# Altium schematic sheet CLK_MUX.schdoc: TEBF0808 - CLK
size A4; DocumentNumber: TEBF0808; Revision: 04; SheetNumber: 23; SheetTotal: 36; Date: 2016-09-29; CompanyName: Trenz Electronic GmbH; Organization: Trenz Electronic GmbH
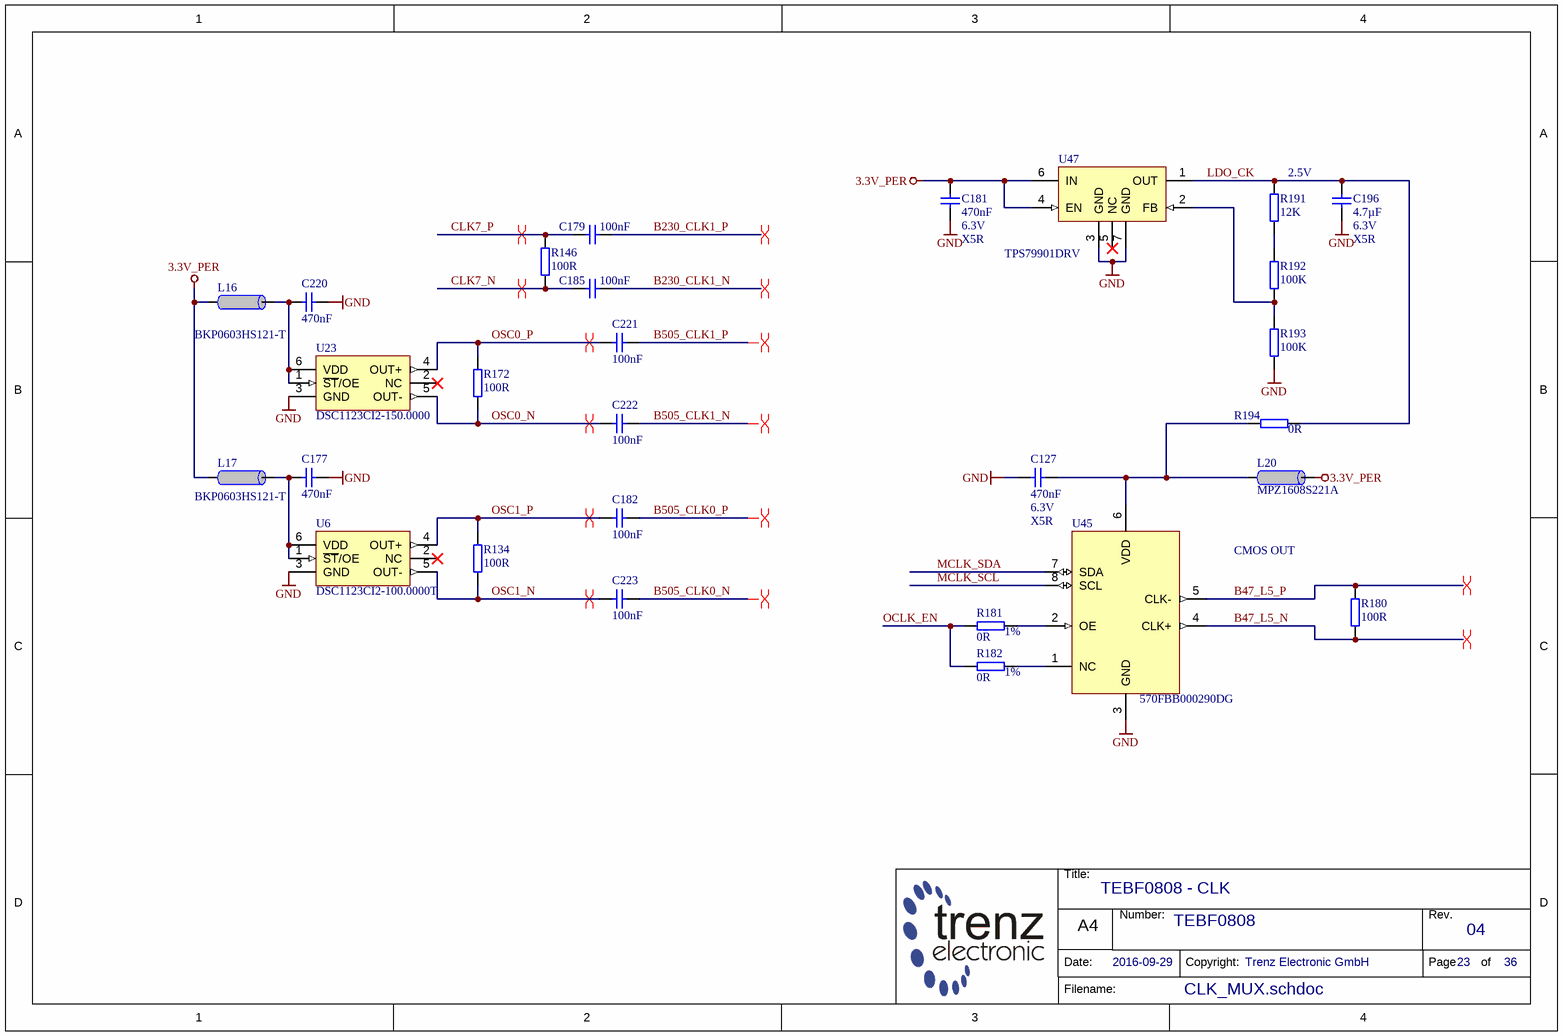
[diagram p0: CLK_MUX.schdoc]

## Parts
C127  470nF  Voltage: 6.3V  Technology: X5R  [CAPC1005X55N]
C177  470nF  [CAPC0603X33N]
C179  100nF  [CAPC0603X33N]
C181  470nF  Voltage: 6.3V  Technology: X5R  [CAPC1005X55N]
C182  100nF  [CAPC0603X33N]
C185  100nF  [CAPC0603X33N]
C196  4.7µF  Voltage: 6.3V  Technology: X5R  [CAPC1005X60N]
C220  470nF  [CAPC0603X33N]
C221  100nF  [CAPC0603X33N]
C222  100nF  [CAPC0603X33N]
C223  100nF  [CAPC0603X33N]
L16  BKP0603HS121-T  [INDC0603X33N]
L17  BKP0603HS121-T  [INDC0603X33N]
L20  MPZ1608S221A  [INDC1608X95N]
R134  100R  [RESC0603X26N]
R146  100R  [RESC1005X40N]
R172  100R  [RESC0603X26N]
R180  100R  [RESC1005X40N]
R181  0R  Tolerance: 1%  [RESC1005X40N]
R182  0R  Tolerance: 1%  [RESC1005X40N]
R191  12K  [RESC1005X40N]
R192  100K  [RESC1005X40N]
R193  100K  [RESC1005X40N]
R194  0R  [RESC1005X40N]
U6  DSC1123CI2-100.0000T  [PSON105P320X250X90-6N]
U23  DSC1123CI2-150.0000  [PSON105P320X250X90-6N]
U45  570FBB000290DG  [OSCCC500X700X180-8N]
U47  TPS79901DRV  [SON65P200X210X80-7N-TI]

## Nets
3.3V_PER: C181.2 L16.1 L17.1 L20.2 U47.4(EN) U47.6(IN)
GND: C127.1 C177.1 C181.1 C196.2 C220.1 R193.1 U6.3(GND) U23.3(GND) U45.3(GND) U47.3(GND) U47.7(GND)
B47_L5_N: R180.2 U45.4(CLK+)
B47_L5_P: R180.1 U45.5(CLK-)
B230_CLK1_N: C185.2
B230_CLK1_P: C179.2
B505_CLK0_N: C223.2
B505_CLK0_P: C182.2
B505_CLK1_N: C222.2
B505_CLK1_P: C221.2
CLK7_N: C185.1 R146.2
CLK7_P: C179.1 R146.1
LDO_CK: C196.1 R191.1 R194.1 U47.1(OUT)
MCLK_SCL: U45.8(SCL)
MCLK_SDA: U45.7(SDA)
OCLK_EN: R181.1 R182.1
OSC0_N: C222.1 R172.1 U23.5(OUT-)
OSC0_P: C221.1 R172.2 U23.4(OUT+)
OSC1_N: C223.1 R134.1 U6.5(OUT-)
OSC1_P: C182.1 R134.2 U6.4(OUT+)
NetC127_2: C127.2 L20.1 R194.2 U45.6(VDD)
NetC177_2: C177.2 L17.2 U6.1(~{ST}/OE) U6.6(VDD)
NetC220_2: C220.2 L16.2 U23.1(~{ST}/OE) U23.6(VDD)
NetR181_2: R181.2 U45.2(OE)
NetR182_2: R182.2 U45.1(NC)
NetR191_2: R191.2 R192.2
NetR192_1: R192.1 R193.2 U47.2(FB)

Not connected (* = marked no-connect by the designer): U6 2(NC)*; U23 2(NC)*; U47 5(NC)*

## Layout directives
differential pair: B47_L5_N, B47_L5_P, B230_CLK1_N, B230_CLK1_P, B505_CLK0_N, B505_CLK0_P, B505_CLK1_N, B505_CLK1_P, CLK7_N, CLK7_P, OSC0_N, OSC0_P, OSC1_N, OSC1_P

## Notes on the sheet
- 2.5V
- CMOS OUT
- Title:
- Number:
- Rev.
- Date:
- A4
- Copyright:
- Page
- of
- Filename:

## Library data of the parts
C127 C181 = 23659: KON 470nF 6,3V X5R SMD; AN: 23659; Value: 470n; Mixed: SMT; Preferred: Yes; Case: 1005 (0402)
C177 C220 = 24921: KON 470nF X5R 6.3V SMD 20%; AN: 24921; Mixed: SMT; Value: 470n; Preferred: Yes; Voltage: 6.3V; Technology: X5R; Case: 0603 (0201); Tolerance: 20%
C179 C182 C185 C221-C223 = 24915: KON 100nF 6.3V X5R SMD 10%; AN: 24915; Mixed: SMT; Value: 100n; Preferred: Yes; Voltage: 6.3V; Technology: X5R; Case: 0603 (0201); Tolerance: 10%
C196 = 24719: KON 4.7µF 6.3V X5R SMD 20%; AN: 24719; Mixed: SMT; Value: 4.7u; Preferred: Yes; Case: 1005 (0402); Tolerance: 20%
L16 L17 = 25393: Ferritdurchführung SMD 0201; AN: 25393; Mixed: SMT; Trenz-Stock: Yes; Tolerance: 25%; Case: 0603 (0201); HelpURL: B:\AD\adlib\datasheet\MULTILAYER CHIP BEAD INDUCTORS BK; Preferred: Yes; H-ART: BKP0603HS121-T
L20 = 22718: Ferritdurchführung MPZ1608S221A; AN: 22718; Mixed: SMT; Trenz-Stock: Yes; Value: 220 OHm @ 100MHz; Case: 1608 (0603); HelpURL: B:\AD\adlib\datasheet\MPZ1608; Preferred: Yes; H-ART: MPZ1608S221A
R134 R172 = 22503: WID SMD 100R 1% 0,05W; AN: 22503; Mixed: SMT; Value: 100; Preferred: Yes; Case: 0603 (0201); Tolerance: 1%; Technology: TK100
R146 R180 = 22507: WID SMD 100R 1% 0,063W; AN: 22507; Mixed: SMT; Value: 100; Preferred: Yes; Tolerance: 1%; Case: 1005 (0402); Technology: TK100
R181 R182 = 22738: WID SMD 0R; AN: 22738; Mixed: SMT; Value: 0; Preferred: Yes; Case: 1005 (0402); Technology: TK100
R191 = 22598: WID SMD 12K 1% 0,063W; AN: 22598; Mixed: SMT; Preferred: Yes; Tolerance: 1%; Case: 1005 (0402); Technology: TK100; Value: 12K
R192 R193 = 22558: WID SMD 100K 1% 0,063W; AN: 22558; Mixed: SMT; Preferred: Yes; Tolerance: 1%; Case: 1005 (0402); Technology: TK100; Value: 100K
R194 = 22738: WID SMD 0R; AN: 22738; Tolerance: 1%; Mixed: SMT; Value: 0; Preferred: Yes; Case: 1005 (0402); Technology: TK100
U6 = 27516: DSC1123CI2-100.0000T 100MHz LVDS clock; AN: 27516; Tolerance: 25ppm; Mixed: SMT; Value: 100M; Case: 3.2 mm x 2.5 mm; HelpURL: B:\AD\adlib\datasheet\DSC11xx; H-ART: DSC1123CI2-100.0000T
U23 = 27517: DSC1123CI2-150.0000 150MHz LVDS clock; AN: 27517; Tolerance: 25ppm; Mixed: SMT; Value: 150M; Case: 3.2 mm x 2.5 mm; HelpURL: B:\AD\adlib\datasheet\DSC11xx; H-ART: DSC1123CI2-150.0000
U45 = 24194: Si570 , LVDS , 2.5V , 250MHz; AN: 24194; Mixed: SMT; Trenz-Stock: Yes; Ordercode: *; Partnumber: *; Rating: *; Price-1$: *; HelpURL: B:\AD\adlib\datasheet\Si570; H-ART: 570FBB000290DG
U47 = 22805: AN: 22805; Mixed: SMT; Trenz-Stock: Yes; Case: SON6; HelpURL: B:\AD\adlib\datasheet\TPS799XX; H-ART: TPS79901DRV